# EasyEDA Pro project sensorboardschematic.epro

# Schematic SensorBoardSchematic
Board Name: 3 SensorBoard; Create Date: 2026-05-11; Page Name: P1; Project Name: To The Moon Together - An Amateur Sounding Rocket; Schematic Name: SensorBoardSchematic; Update Date: 2026-05-13; Company: EasyEDA.com; Page Size: A4; Version: V1.0
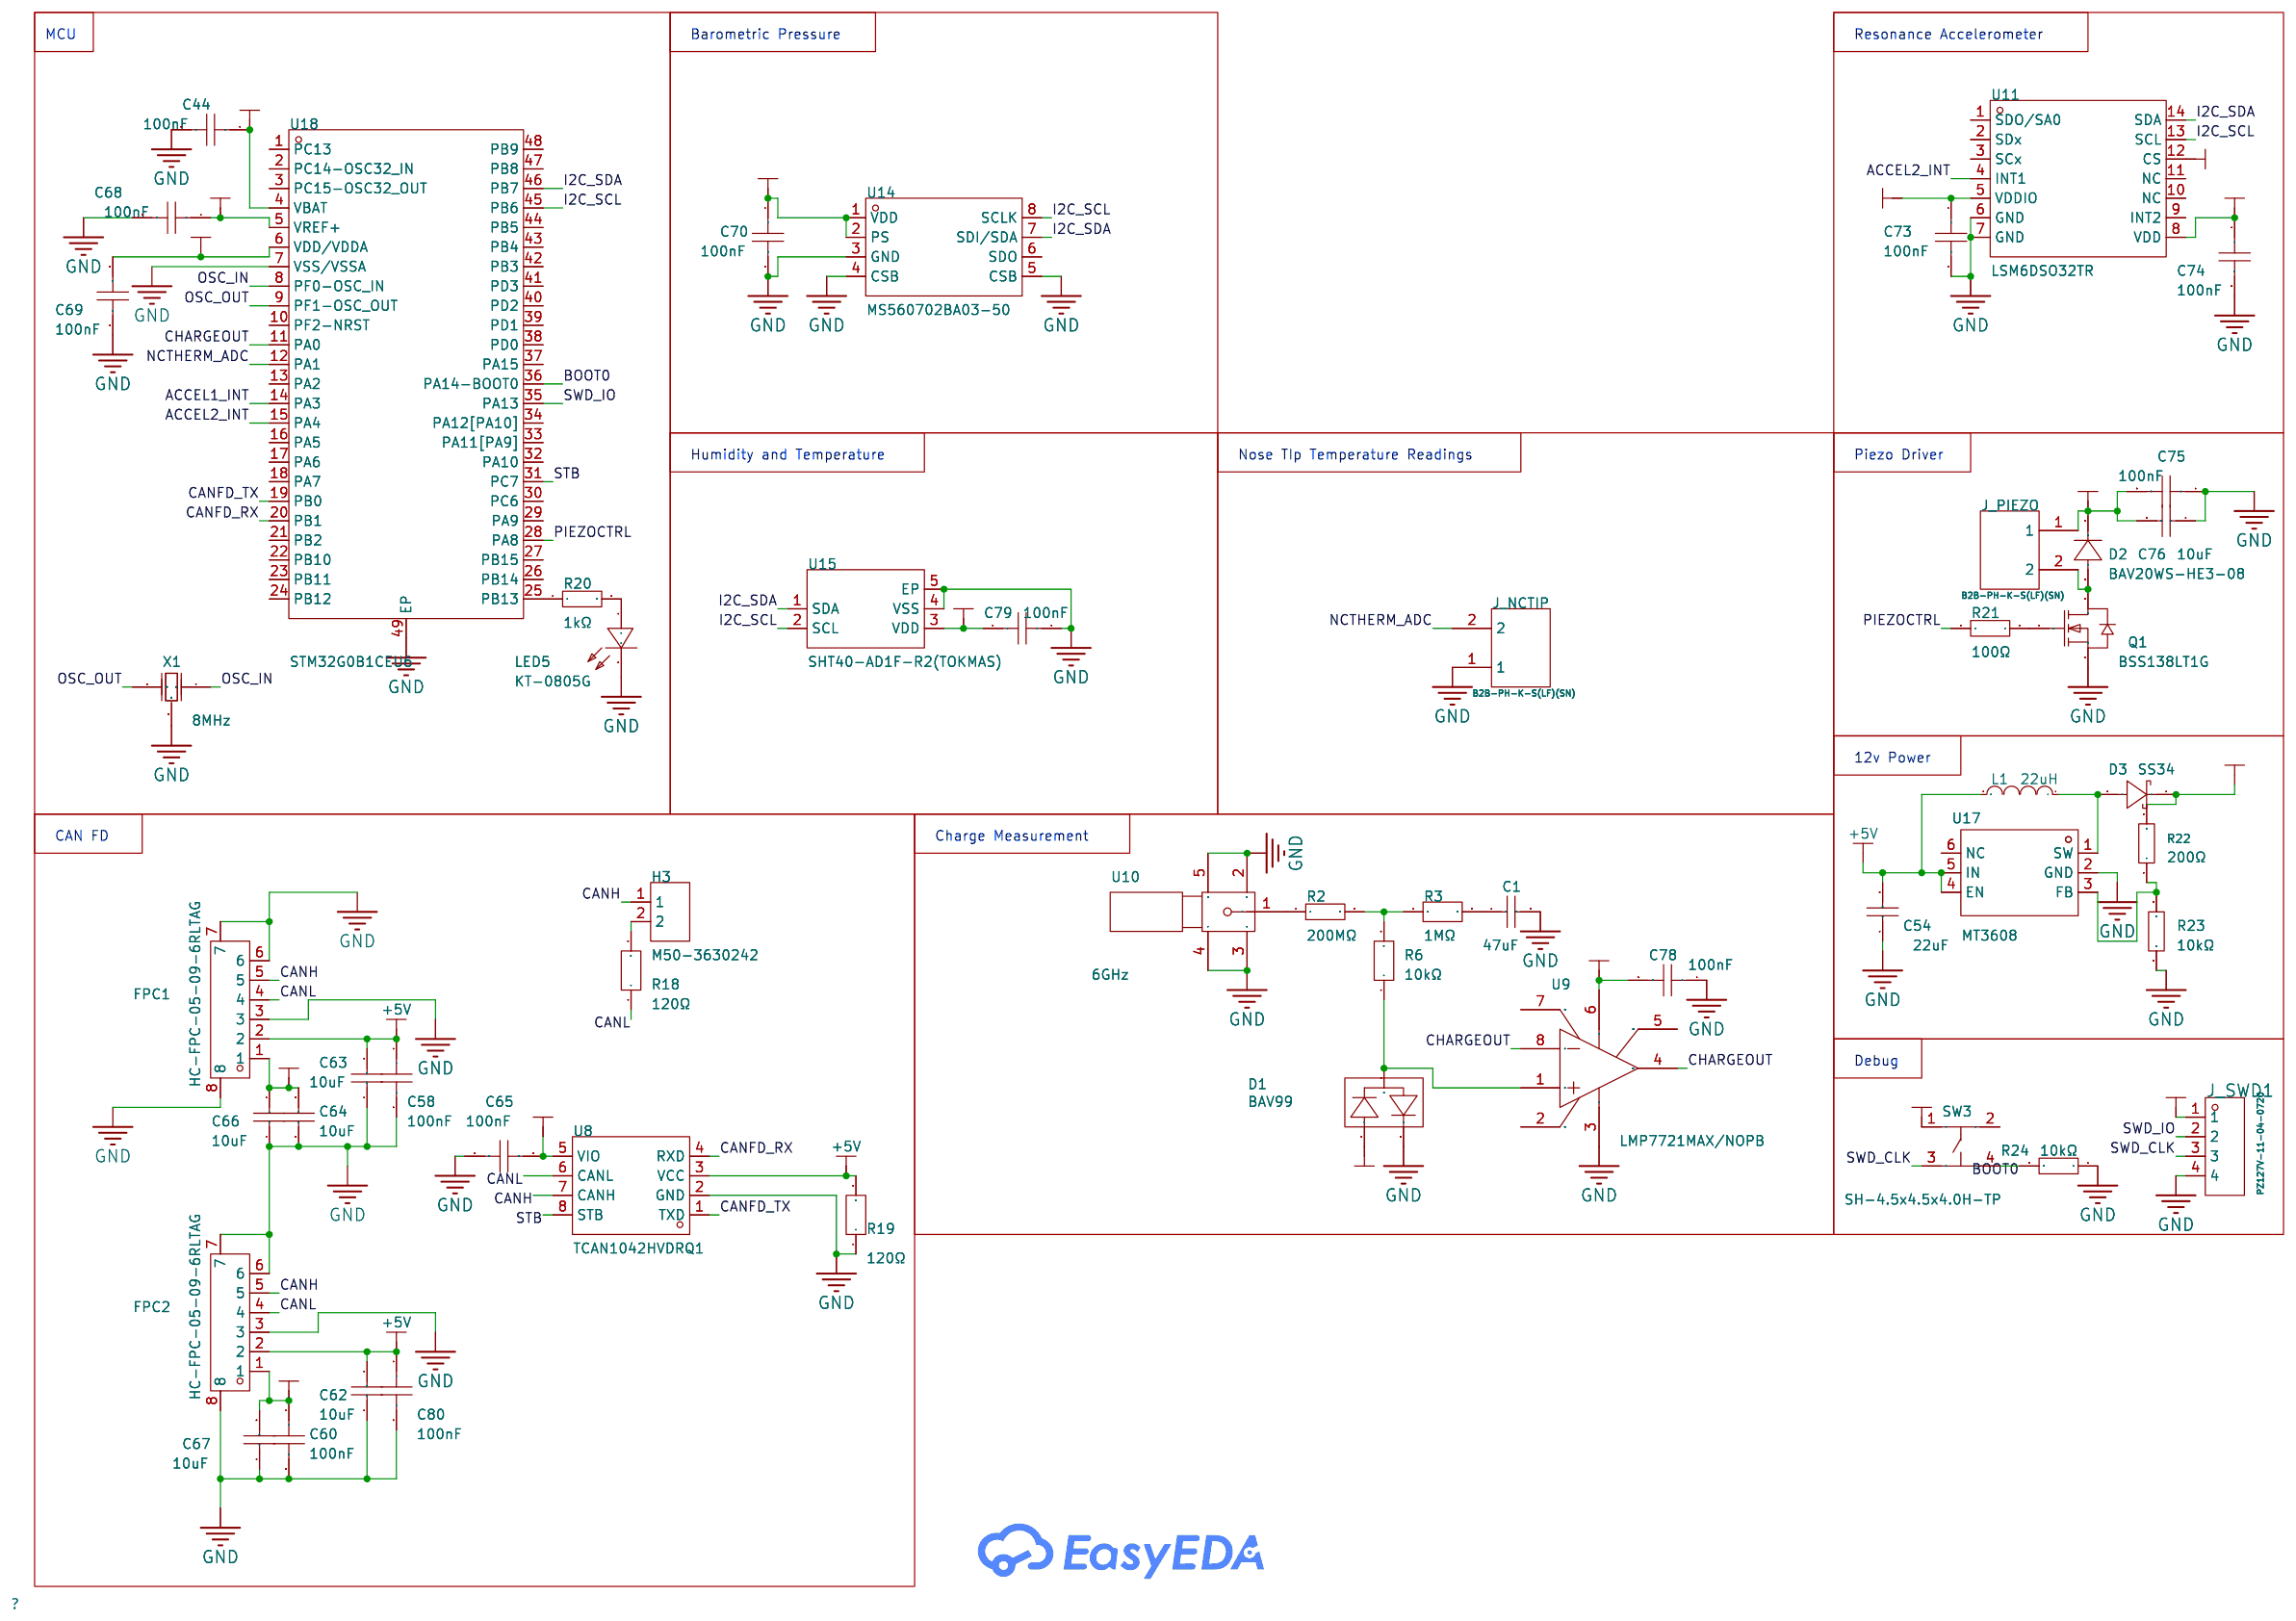
[diagram p0: schematic sheet]

## Parts
C1  47uF  [C0805]
C44  100nF  [C0402]
C54  22uF  [C1206]
C58  100nF  [C0402]
C60  100nF  [C0402]
C62  10uF  [C0402]
C63  10uF  [C0402]
C64  10uF  [C0402]
C65  100nF  [C0402]
C66  10uF  [C0402]
C67  10uF  [C0402]
C68  100nF  [C0402]
C69  100nF  [C0402]
C70  100nF  [C0402]
C73  100nF  [C0402]
C74  100nF  [C0402]
C75  100nF  [C0402]
C76  10uF  [C0402]
C78  100nF  [C0402]
C79  100nF  [C0402]
C80  100nF  [C0402]
D1  BAV99  [SOT-23-3_L2.9-W1.3-P1.90-LS2.4-BR]
D2  BAV20WS-HE3-08  [SOD-323_L1.8-W1.3-LS2.7-RD]
D3  SS34  [SMA_L4.2-W2.7-LS5.0-RD]
FPC1  HC-FPC-05-09-6RLTAG  [FPC-SMD_6P-P0.50_HC-FPC-05-09-6RLTAG]
FPC2  HC-FPC-05-09-6RLTAG  [FPC-SMD_6P-P0.50_HC-FPC-05-09-6RLTAG]
H3  M50-3630242  [HDR-SMD_2P-P1.27_M50-3630242]
J_NCTIP  B2B-PH-K-S(LF)(SN)  [CONN-TH_B2B-PH-K-S]
J_PIEZO  B2B-PH-K-S(LF)(SN)  [CONN-TH_B2B-PH-K-S]
J_SWD1  PZ127V-11-04-0720  [HDR-TH_4P-P1.27-V-M]
L1  22uH  [IND-SMD_L3.2-W2.5]
LED5  KT-0805G  [LED0805-R-RD]
Q1  BSS138LT1G  [SOT-23-3_L2.9-W1.6-P1.90-LS2.8-BR]
R2  200MΩ  [RES-TH_L14.7-W2.54-P10.2-D0.8]
R3  1MΩ  [R0402]
R6  10kΩ  [R0402]
R18  120Ω  [R0402]
R19  120Ω  [R0402]
R20  1kΩ  [R0402]
R21  100Ω  [R0402]
R22  200Ω  [R0603]
R23  10kΩ  [R0402]
R24  10kΩ  [R0402]
SW3  SH-4.5x4.5x4.0H-TP  [SW-SMD_4P-SH-4.5X4.5X4.0H-TP]
U8  TCAN1042HVDRQ1  [SOIC-8_L4.9-W3.9-P1.27-LS6.0-BL]
U9  LMP7721MAX/NOPB  [SOIC-8_L4.9-W3.9-P1.27-LS6.0-BL]
U10  6GHz  [MMCX-TH_DL-MMCX-KWE]
U11  LSM6DSO32TR  [LGA-14_L3.0-W2.5-P0.50-TL]
U14  MS560702BA03-50  [SENSOR-SMD_MS560702BA03-50]
U15  SHT40-AD1F-R2(TOKMAS)  [DFN-4_L1.5-W1.5-P0.80-TL-EP]
U17  MT3608  [SOT-23-6_L2.9-W1.6-P0.95-LS2.8-BL]
U18  STM32G0B1CEU6  [UFQFPN-48_L7.0-W7.0-P0.50-BL-EP]
X1  8MHz  [OSC-SMD_3P-L3.2-W1.3-P1.20-L]

## Library data of the parts
C1 = CL21A476MQYNNNE: Capacitance:47uF Tolerance:±20% Tolerance:±20% Voltage Rating:6.3V Temperature Coefficient:X5R; LCSC Part Name: 47uF ±20% 6.3V; Supplier Part: C16780; Manufacturer: SAMSUNG(三星); Supplier Footprint: 0805; JLCPCB Part Class: Basic Part; Datasheet: https://item.szlcsc.com/datasheet/CL21A476MQYNNNE/17464.html; Supplier: LCSC; Tolerance: ±20%; Voltage Rating: 6.3V; Temperature Coefficient: X5R
C44 C58 C60 C65 C68-C70 C73-C75 C78-C80 = CL05B104KO5NNNC: Capacitance:100nF Tolerance:±10% Tolerance:±10% Voltage Rating:16V Temperature Coefficient:X7R; LCSC Part Name: 100nF ±10% 16V; Supplier Part: C1525; Manufacturer: SAMSUNG(三星); Supplier Footprint: 0402; JLCPCB Part Class: Basic Part; Datasheet: https://item.szlcsc.com/datasheet/CL05B104KO5NNNC/1877.html; Supplier: LCSC; Tolerance: ±10%; Voltage Rating: 16V; Temperature Coefficient: X7R
C54 = CL31A226KAHNNNE: Capacitance:22uF Tolerance:±10% Tolerance:±10% Voltage Rating:25V Temperature Coefficient:X5R; LCSC Part Name: 22uF ±10% 25V; Supplier Part: C12891; Manufacturer: SAMSUNG(三星); Supplier Footprint: 1206; JLCPCB Part Class: Basic Part; Datasheet: https://item.szlcsc.com/datasheet/CL31A226KAHNNNE/13537.html; Supplier: LCSC; Tolerance: ±10%; Voltage Rating: 25V; Temperature Coefficient: X5R
C62-C64 C66 C67 C76 = CL05A106MQ5NUNC: Capacitance:10uF Tolerance:±20% Tolerance:±20% Voltage Rating:6.3V Temperature Coefficient:X5R; LCSC Part Name: 10uF ±20% 6.3V; Supplier Part: C15525; Manufacturer: SAMSUNG(三星); Supplier Footprint: 0402; JLCPCB Part Class: Basic Part; Datasheet: https://item.szlcsc.com/datasheet/CL05A106MQ5NUNC/16204.html; Supplier: LCSC; Tolerance: ±20%; Voltage Rating: 6.3V; Temperature Coefficient: X5R
D1 = BAV99_C916421: Diode Configuration:1 Pair Series Connection Voltage - Forward(Vf@If):1.25V@150mA Voltage - DC Reverse(Vr):75V Current - Rectified:215mA Pd - Power Dissipation:350mW Reverse Leakage Current (Ir):1uA@75V Reverse Recovery Time (trr):4ns Operating Junction T; LCSC Part Name: 75V 215mA; Supplier Part: C916421; Manufacturer: JSMSEMI(杰盛微); Supplier Footprint: SOT-23; JLCPCB Part Class: Extended Part; Datasheet: https://item.szlcsc.com/datasheet/BAV99/990917.html; Supplier: LCSC; Diode Configuration: 1 Pair Series Connection; Voltage - Forward(Vf@If): 1.25V@150mA; Voltage - DC Reverse(Vr): 75V; Current - Rectified: 215mA; Pd - Power Dissipation: 350mW; Reverse Leakage Current (Ir): 1uA@75V; Reverse Recovery Time (trr): 4ns; Operating Junction Temperature Range: -65℃~+150℃; Non-Repetitive Peak Forward Surge Current: 2A
D2 = BAV20WS-HE3-08: Diode Configuration:1 Independent Pd - Power Dissipation:200mW Current - Rectified:250mA Voltage - DC Reverse(Vr):150V Voltage - Forward(Vf@If):1.25V@200mA Non-Repetitive Peak Forward Surge Current:1A Reverse Leakage Current (Ir):100nA@150V Reverse Recove; LCSC Part Name: 150V 250mA; Supplier Part: C3151637; Manufacturer: VISHAY(威世); Supplier Footprint: SOD-323; JLCPCB Part Class: Extended Part; Datasheet: https://item.szlcsc.com/datasheet/BAV20WS-HE3-08/3712173.html; Supplier: LCSC; Diode Configuration: 1 Independent; Pd - Power Dissipation: 200mW; Current - Rectified: 250mA; Voltage - DC Reverse(Vr): 150V; Voltage - Forward(Vf@If): 1.25V@200mA; Non-Repetitive Peak Forward Surge Current: 1A; Reverse Leakage Current (Ir): 100nA@150V; Reverse Recovery Time (trr): 50ns; Operating Junction Temperature Range: -55℃~+150℃
D3 = SS34_C2837271: Diode Configuration:- Voltage - Forward(Vf@If):550mV@3A Voltage - DC Reverse(Vr):40V Current - Rectified:3A Reverse Leakage Current (Ir):-; LCSC Part Name: 电压:40V 电流:3A; Supplier Part: C2837271; Manufacturer: JSMSEMI(杰盛微); Supplier Footprint: SMA(DO-214AC); JLCPCB Part Class: Extended Part; Datasheet: https://item.szlcsc.com/datasheet/SS34/3007843.html; Supplier: LCSC; Voltage - Forward(Vf@If): 550mV@3A; Voltage - DC Reverse(Vr): 40V; Current - Rectified: 3A
FPC1 FPC2 = HC-FPC-05-09-6RLTAG: Locking Feature:Hinged Lid Contact Type:Double-Sided Contacts, Top and Bottom Entry Number of Contacts:6P Pitch:0.5mm Mounting Type:Surface Mount, Right Angle FFC, FCB Thickness:0.3mm FFC, FCB Thickness:0.3mm Height Above Board:1mm Contact Material:Copper; LCSC Part Name: 翻盖式 双侧触点/上下接 P数:6P 间距:0.5mm; Supplier Part: C5213748; Manufacturer: HCTL(华灿天禄); Supplier Footprint: SMD,P=0.5mm,卧贴; JLCPCB Part Class: Extended Part; Datasheet: https://item.szlcsc.com/datasheet/HC-FPC-05-09-6RLTAG/5909040.html; Supplier: LCSC; Locking Feature: Hinged Lid; Contact Type: Double-Sided Contacts, Top and Bottom Entry; Number of Contacts: 6P; Pitch: 0.5mm; Mounting Type: Surface Mount, Right Angle; FFC, FCB Thickness: 0.3mm; Height Above Board: 1mm; Contact Material: Copper Alloy; Operating Temperature: -55℃~+85℃
H3 = M50-3630242: Pitch:1.27mm Row Spacing:- Circluar Pins/Square Pins:Pin Header Mounting Type:Surface Mount,Vertical Number of Rows:1 Number of Pins:2P Current Rating:1A Length of Mating Pin:3mm Insulation Height:1mm Length of End Connection Pin:- Contact Material:Brass; LCSC Part Name: 间距:1.27mm 方针 立贴; Supplier Part: C7297891; Manufacturer: Harwin; Supplier Footprint: SMD,P=1.27mm; JLCPCB Part Class: Extended Part; Datasheet: https://item.szlcsc.com/datasheet/M50-3630242/8267898.html; Supplier: LCSC; Pitch: 1.27mm; Circluar Pins/Square Pins: Pin Header; Mounting Type: Surface Mount,Vertical; Number of Rows: 1; Number of Pins: 2P; Current Rating: 1A; Length of Mating Pin: 3mm; Insulation Height: 1mm; Contact Material: Brass; Contact Plating: Tin; Operating Temperature: -40℃~+105℃; Color: Black
J_NCTIP J_PIEZO = B2B-PH-K-S(LF)(SN): Pins Structure:1x2P Pitch:2mm Mounting Type:Through Hole Reference Series:PH Number of Pins:2P Number of Rows:1 Number of PINs Per Row:2 Row Spacing:- Current Rating:2A Contact Material:Brass Contact Plating:Tin Operating Temperature:-25℃~+85℃ Operating T; LCSC Part Name: 1x2P 间距:2mm 直插 系列:PH; Supplier Part: C131337; Manufacturer: JST; Supplier Footprint: 插件,P=2mm; JLCPCB Part Class: Extended Part; Datasheet: https://item.szlcsc.com/datasheet/B2B-PH-K-S(LF)(SN)/142630.html; Supplier: LCSC; Pins Structure: 1x2P; Pitch: 2mm; Mounting Type: Through Hole; Reference Series: PH; Number of Pins: 2P; Number of Rows: 1; Number of PINs Per Row: 2; Current Rating: 2A; Contact Material: Brass; Contact Plating: Tin; Operating Temperature: -25℃~+85℃; Voltage Rating: 100V; Plastic Material: PA66; Flame Retardant Rating: UL94V-0; Supplementary Features: K Pin; Color: White; Z-Height of the Board: 6mm; X-Length of Bottom Edge on Board (Spacing Line): 5.9mm; Y-Width of Bottom Edge on Board: 4.5mm
J_SWD1 = PZ127V-11-04-0720: Pin Structure:1x4P Pitch:1.27mm Row Spacing:- Circluar Pins/Square Pins:Pin Header Mounting Type:Through Hole Number of Rows:1 Number of Pins:4P Current Rating:1A Voltage Rating (Max):- Length of Mating Pin:3.9mm Insulation Height:1mm Length of End Connec; LCSC Part Name: 1x4P 间距:1.27mm 方针 直插; Supplier Part: C541879; Manufacturer: XFCN(兴飞); Supplier Footprint: 插件,P=1.27mm; JLCPCB Part Class: Extended Part; Datasheet: https://item.szlcsc.com/datasheet/PZ127V-11-04-0720/562500.html; Supplier: LCSC; Pin Structure: 1x4P; Pitch: 1.27mm; Circluar Pins/Square Pins: Pin Header; Mounting Type: Through Hole; Number of Rows: 1; Number of Pins: 4P; Current Rating: 1A; Length of Mating Pin: 3.9mm; Insulation Height: 1mm; Length of End Connection Pin: 2.3mm; Contact Material: Brass; Operating Temperature: -40℃~+105℃; Color: Black
L1 = NLV32T-220J-EF: Inductance: Tolerance:±5% Tolerance:±5% Rated Current: Saturation Current (Isat):- DC Resistance (DCR): Ratings:-; LCSC Part Name: 22uH ±5%; Supplier Part: C295143; Manufacturer: TDK; Supplier Footprint: 1210; JLCPCB Part Class: Extended Part; Datasheet: https://atta.szlcsc.com/upload/public/pdf/source/20190114/C295361_7F4084769062E2B02C18E7F2085EC2BC.pdf; Supplier: LCSC; Tolerance: ±5%
LED5 = KT-0805G: Lamp Holder Type:- Illumination Color:Emerald Green Voltage - Forward(Vf):2.6V~3.1V Voltage - Forward(Vf):2.6V~3.1V Power(Watts):100mW Forward Current:5mA Wavelength - Dominant:513nm~528nm Wavelength - Dominant:513nm~528nm Peak Wavelength:525nm Diode Conf; LCSC Part Name: 0805 翠绿 高亮; Supplier Part: C2297; Manufacturer: KENTO; Supplier Footprint: 0805; JLCPCB Part Class: Basic Part; Datasheet: https://item.szlcsc.com/datasheet/KT-0805G/2670.html; Supplier: LCSC; Illumination Color: Emerald Green; Voltage - Forward(Vf): 2.6V~3.1V; Power(Watts): 100mW; Forward Current: 5mA; Wavelength - Dominant: 513nm~528nm; Peak Wavelength: 525nm; Diode Configuration: Discrete Diode; Lens Color: Water Clear; Luminous Intensity: 430mcd; Viewing Angle: 120°; Operating Temperature: -40℃~+85℃
Q1 = BSS138LT1G: Number:1 N-Channel Drain to Source Voltage:50V Current - Continuous Drain(Id):200mA RDS(on):5.6Ω@2.75V Pd - Power Dissipation:225mW Gate Threshold Voltage (Vgs(th)):500mV Input Capacitance(Ciss):50pF@25V Reverse Transfer Capacitance (Crss@Vds):5pF@25V Ope; LCSC Part Name: 1个N沟道 耐压:50V 电流:200mA; Supplier Part: C82045; Manufacturer: onsemi(安森美); Supplier Footprint: SOT-23; JLCPCB Part Class: Extended Part; Datasheet: https://item.szlcsc.com/datasheet/BSS138LT1G/83200.html; Supplier: LCSC; Number: 1 N-Channel; Drain to Source Voltage: 50V; Current - Continuous Drain(Id): 200mA; RDS(on): 5.6Ω@2.75V; Pd - Power Dissipation: 225mW; Gate Threshold Voltage (Vgs(th)): 500mV; Input Capacitance(Ciss): 50pF@25V; Reverse Transfer Capacitance (Crss@Vds): 5pF@25V; Operating Temperature: -55℃~+150℃
R2 = SM102032006FE: Type:Thick Film Resistor Resistance: Tolerance:±1% Tolerance:±1% Power(Watts):1W Temperature Coefficient:±50ppm/℃ Temperature Coefficient:±50ppm/℃ Operating Temperature:-55℃~+110℃ Operating Temperature:-55℃~+110℃; LCSC Part Name: 厚膜电阻 200MΩ ±1% 1W; Supplier Part: C2641611; Manufacturer: Ohmite; Supplier Footprint: 插件; JLCPCB Part Class: Extended Part; Datasheet: https://item.szlcsc.com/datasheet/SM102032006FE/2733517.html; Supplier: LCSC; Type: Thick Film Resistor; Tolerance: ±1%; Power(Watts): 1W; Temperature Coefficient: ±50ppm/℃; Operating Temperature: -55℃~+110℃
R3 = FRC0402F1004TS: Type:Thick Film Resistor Resistance:1MΩ Tolerance:±1% Tolerance:±1% Power(Watts):62.5mW Voltage-Supply(Max):50V Temperature Coefficient:±100ppm/℃ Temperature Coefficient:±100ppm/℃ Operating Temperature:-55℃~+155℃ Operating Temperature:-55℃~+155℃; LCSC Part Name: 1MΩ ±1% 62.5mW 厚膜电阻; Supplier Part: C2909328; Manufacturer: FOJAN(富捷); Supplier Footprint: 0402; JLCPCB Part Class: Extended Part; Supplier: LCSC; Type: Thick Film Resistor; Tolerance: ±1%; Power(Watts): 62.5mW; Voltage-Supply(Max): 50V; Temperature Coefficient: ±100ppm/℃; Operating Temperature: -55℃~+155℃
R6 = FRC0402F1002TS: Type:Thick Film Resistor Resistance:10kΩ Tolerance:±1% Tolerance:±1% Power(Watts):62.5mW Voltage-Supply(Max):50V Temperature Coefficient:±100ppm/℃ Temperature Coefficient:±100ppm/℃ Operating Temperature:-55℃~+155℃ Operating Temperature:-55℃~+155℃; LCSC Part Name: 10kΩ ±1% 62.5mW 厚膜电阻; Supplier Part: C2906861; Manufacturer: FOJAN(富捷); Supplier Footprint: 0402; JLCPCB Part Class: Extended Part; Supplier: LCSC; Type: Thick Film Resistor; Tolerance: ±1%; Power(Watts): 62.5mW; Voltage-Supply(Max): 50V; Temperature Coefficient: ±100ppm/℃; Operating Temperature: -55℃~+155℃
R18 R19 = FRC0402F1200TS: Type:Thick Film Resistor Resistance:120Ω Tolerance:±1% Tolerance:±1% Power(Watts):62.5mW Voltage-Supply(Max):50V Temperature Coefficient:±100ppm/℃ Temperature Coefficient:±100ppm/℃ Operating Temperature:-55℃~+155℃ Operating Temperature:-55℃~+155℃; LCSC Part Name: 120Ω ±1% 62.5mW 厚膜电阻; Supplier Part: C2909315; Manufacturer: FOJAN(富捷); Supplier Footprint: 0402; JLCPCB Part Class: Extended Part; Datasheet: https://item.szlcsc.com/datasheet/FRC0402F1200TS/3186250.html; Supplier: LCSC; Type: Thick Film Resistor; Tolerance: ±1%; Power(Watts): 62.5mW; Voltage-Supply(Max): 50V; Temperature Coefficient: ±100ppm/℃; Operating Temperature: -55℃~+155℃
R20 = 0402WGF1001TCE: Type:Thick Film Resistor Resistance:1kΩ Tolerance:±1% Tolerance:±1% Power(Watts):62.5mW Voltage-Supply(Max):50V Temperature Coefficient:±100ppm/℃ Temperature Coefficient:±100ppm/℃ Operating Temperature:-55℃~+155℃ Operating Temperature:-55℃~+155℃; LCSC Part Name: 1kΩ ±1% 62.5mW 厚膜电阻; Supplier Part: C11702; Manufacturer: UNI-ROYAL(厚声); Supplier Footprint: 0402; JLCPCB Part Class: Basic Part; Datasheet: https://item.szlcsc.com/datasheet/0402WGF1001TCE/12256.html; Supplier: LCSC; Type: Thick Film Resistor; Tolerance: ±1%; Power(Watts): 62.5mW; Voltage-Supply(Max): 50V; Temperature Coefficient: ±100ppm/℃; Operating Temperature: -55℃~+155℃
R21 = 0402WGF1000TCE: Type:Thick Film Resistors Resistance: Tolerance:±1% Tolerance:±1% Power(Watts): Overload Voltage (Max): Temperature Coefficient:±200ppm/℃ Temperature Coefficient:±200ppm/℃ Operating Temperature Range:-55℃~+155℃ Operating Temperature Range:-55℃~+155℃; LCSC Part Name: 100Ω ±1% 62.5mW 厚膜电阻; Supplier Part: C25076; Manufacturer: UNI-ROYAL(厚声); Supplier Footprint: 0402; JLCPCB Part Class: Basic Part; Datasheet: https://atta.szlcsc.com/upload/public/pdf/source/20200306/C422600_1E6D84923E4A46A82E41ADD87F860B5C.pdf; Supplier: LCSC; Type: Thick Film Resistors; Tolerance: ±1%; Temperature Coefficient: ±200ppm/℃; Operating Temperature Range: -55℃~+155℃
R22 = 0603WAF2000T5E: Type:Thick Film Resistor Resistance:200Ω Tolerance:±1% Tolerance:±1% Power(Watts):100mW Voltage-Supply(Max):75V Temperature Coefficient:±100ppm/℃ Temperature Coefficient:±100ppm/℃ Operating Temperature:-55℃~+155℃ Operating Temperature:-55℃~+155℃; LCSC Part Name: 200Ω ±1% 100mW 厚膜电阻; Supplier Part: C8218; Manufacturer: UNI-ROYAL(厚声); Supplier Footprint: 0603; JLCPCB Part Class: Basic Part; Datasheet: https://item.szlcsc.com/datasheet/0603WAF2000T5E/8708.html; Supplier: LCSC; Type: Thick Film Resistor; Tolerance: ±1%; Power(Watts): 100mW; Voltage-Supply(Max): 75V; Temperature Coefficient: ±100ppm/℃; Operating Temperature: -55℃~+155℃
R23 R24 = 0402WGF1002TCE: Type:Thick Film Resistor Resistance:10kΩ Tolerance:±1% Tolerance:±1% Power(Watts):62.5mW Voltage-Supply(Max):50V Temperature Coefficient:±100ppm/℃ Temperature Coefficient:±100ppm/℃ Operating Temperature:-55℃~+155℃ Operating Temperature:-55℃~+155℃; LCSC Part Name: 10kΩ ±1% 62.5mW 厚膜电阻; Supplier Part: C25744; Manufacturer: UNI-ROYAL(厚声); Supplier Footprint: 0402; JLCPCB Part Class: Basic Part; Datasheet: https://item.szlcsc.com/datasheet/0402WGF1002TCE/26487.html; Supplier: LCSC; Type: Thick Film Resistor; Tolerance: ±1%; Power(Watts): 62.5mW; Voltage-Supply(Max): 50V; Temperature Coefficient: ±100ppm/℃; Operating Temperature: -55℃~+155℃
SW3 = SH-4.5x4.5x4.0H-TP: LCSC Part Name: TS4540TP 250gf编带; Supplier Part: C52092029; Manufacturer: SHOU HAN(首韩); Supplier Footprint: SMD; JLCPCB Part Class: Extended Part; Datasheet: https://item.szlcsc.com/datasheet/SH-4.5x4.5x4.0H-TP/54864053.html; Supplier: LCSC
U8 = TCAN1042HVDRQ1: Type:CAN FD Transceiver Data Rate:2Mbps Voltage - Supply:4.5V~5.5V Voltage - Supply:4.5V~5.5V Current - Supply:80mA Operating Temperature:-55℃~+125℃ Operating Temperature:-55℃~+125℃ Number of Channels:- Quiescent Supply Current:22uA; LCSC Part Name: TCAN1042-Q1 汽车故障保护 CAN 收发器，带 CAN FD; Supplier Part: C485807; Manufacturer: TI(德州仪器); Supplier Footprint: SOIC-8; JLCPCB Part Class: Extended Part; Datasheet: https://www.ti.com/cn/lit/gpn/tcan1042hv-q1; Supplier: LCSC; Type: CAN FD Transceiver; Data Rate: 2Mbps; Voltage - Supply: 4.5V~5.5V; Current - Supply: 80mA; Operating Temperature: -55℃~+125℃; Quiescent Supply Current: 22uA
U9 = LMP7721MAX/NOPB: Number of Channels:1 Maximum Power Supply Range (Vdd-Vss):5.5V Rail to Rail:Rail-to-Rail Output Gain Bandwidth Product:17MHz Vos - Input Offset Voltage:26uV Input Offset Voltage Drift(Vos TC):1.5uV/℃ Slew Rate:12.76V/us Ib - Input Bias Current:0.003pA Inp; LCSC Part Name: 超低输入偏置电流精密放大器; Supplier Part: C2864387; Manufacturer: TI(德州仪器); Supplier Footprint: SOIC-8; JLCPCB Part Class: Extended Part; Datasheet: https://www.ti.com/cn/lit/gpn/lmp7721; Supplier: LCSC; Number of Channels: 1; Maximum Power Supply Range (Vdd-Vss): 5.5V; Rail to Rail: Rail-to-Rail Output; Gain Bandwidth Product: 17MHz; Vos - Input Offset Voltage: 26uV; Input Offset Voltage Drift(Vos TC): 1.5uV/℃; Slew Rate: 12.76V/us; Ib - Input Bias Current: 0.003pA; Input Offset Current(Ios): 0.006pA; Input Voltage Noise Density: 6.5nV/√Hz@1kHz; Common Mode Rejection Ratio(CMRR): 100dB; Quiescent Current: 1.3mA; Output Current: 46mA; Operating Temperature: -40℃~+125℃; Single supply: 1.8V~5.5V
U10 = BWMMCX-KWE: Connector Type:Board Side Interface:Inner Bore Number of Ports:1 Interface Diameter:3.45mm Interface Length/Height:6.8mm Frequency:6GHz RF Series:- Impedance:50Ω Style:Elbow Operating Temperature Range:- Operating Temperature Range:-; LCSC Part Name: 内孔 弯头; Supplier Part: C5137199; Manufacturer: BAT WIRELESS(蝙蝠无线); Supplier Footprint: 插件; JLCPCB Part Class: Extended Part; Datasheet: https://item.szlcsc.com/datasheet/BWMMCX-KWE/5745896.html; Supplier: LCSC; Connector Type: Board Side; Interface: Inner Bore; Number of Ports: 1; Interface Diameter: 3.45mm; Interface Length/Height: 6.8mm; Impedance: 50Ω; Style: Elbow
U11 = LSM6DSO32TR: Sensor Type:加速度计陀螺仪 Operating Temperature:-40℃~+85℃ Operating Temperature:-40℃~+85℃; Supplier Part: C1864162; Manufacturer: ST(意法半导体); Supplier Footprint: LGA-14(2.5x3); JLCPCB Part Class: Extended Part; Datasheet: https://atta.szlcsc.com/upload/public/pdf/source/20210701/34CD2F0BBC0E28C2A99EB6D9CC8DCB24.pdf; Supplier: LCSC; Sensor Type: 加速度计陀螺仪; Operating Temperature: -40℃~+85℃
U14 = MS560702BA03-50: Pressure range:1Kpa~1.2bar Pressure range:1Kpa~1.2bar Voltage - Supply:1.8V~3.6V Voltage - Supply:1.8V~3.6V Standby Current:140nA Interface:SPI；I2C Module:Yes Absolute Accuracy:1.5mbar Relative Accuracy:- Features:片内温度输出；集成ADC与数字接口；片内校准与非易失存储 Temperature; LCSC Part Name: MS5607-02BA03; Supplier Part: C97627; Manufacturer: TE Connectivity(泰科电子); Supplier Footprint: SMD-8P; JLCPCB Part Class: Extended Part; Datasheet: https://item.szlcsc.com/datasheet/MS560702BA03-50/98835.html; Supplier: LCSC; Pressure range: 1Kpa~1.2bar; Voltage - Supply: 1.8V~3.6V; Standby Current: 140nA; Interface: SPI；I2C; Module: Yes; Absolute Accuracy: 1.5mbar; Features: 片内温度输出；集成ADC与数字接口；片内校准与非易失存储; Operating Temperature: -40℃~+85℃
U15 = SHT40-AD1F-R2(TOKMAS): Supplier Part: C54823945; Manufacturer: Tokmas(托克马斯); Supplier Footprint: DFN-4(1.5x1.5); JLCPCB Part Class: Extended Part; Datasheet: https://item.szlcsc.com/datasheet/SHT40-AD1F-R2(TOKMAS)/58293138.html; Supplier: LCSC
U17 = MT3608: Function:Boost Output Type:Adjustable Voltage - Supply:2V~24V Voltage - Supply:2V~24V Output Voltage:- Output Voltage:- Output Current:2A Frequency - Switching:1.2MHz Frequency - Switching:1.2MHz Operating Temperature:-40℃~+85℃ Operating Temperature:-40℃~; LCSC Part Name: 老版本 高效1.2MHz 2A升压转换器; Supplier Part: C84817; Manufacturer: 西安航天民芯; Supplier Footprint: SOT-23-6; JLCPCB Part Class: Extended Part; Datasheet: https://item.szlcsc.com/datasheet/MT3608/85988.html; Supplier: LCSC; Function: Boost; Output Type: Adjustable; Voltage - Supply: 2V~24V; Output Current: 2A; Frequency - Switching: 1.2MHz; Operating Temperature: -40℃~+85℃; Synchronous Rectifier: No; Number of Outputs: 1; Topology: Boost; Quiescent Current: 100uA；1.6mA; Switch tube (built-in/external): Built-in
U18 = STM32G0B1CEU6: LCSC Part Name: 主流Arm Cortex-M0+ 32位MCU，最高512KB闪存，144KB内存，6个USART，定时器，ADC，DAC，通信接口，1.7-3.6V; Supplier Part: C2829190; Manufacturer: ST(意法半导体); Supplier Footprint: UFQFPN-48(7x7); JLCPCB Part Class: Extended Part; Datasheet: https://item.szlcsc.com/datasheet/STM32G0B1CEU6/2979251.html; Supplier: LCSC
X1 = CSTNE8M00GH5C000R0: Frequency:8MHz Built - in Load Capacitance:33pF Resonant Impedance:40Ω Operating Temperature:-40℃~+125℃ Operating Temperature:-40℃~+125℃; LCSC Part Name: 8MHz ±0.07% 内置负载电容:33pF; Supplier Part: C341525; Manufacturer: muRata(村田); Supplier Footprint: SMD3213-3P; JLCPCB Part Class: Extended Part; Datasheet: https://item.szlcsc.com/datasheet/CSTNE8M00GH5C000R0/318917.html; Supplier: LCSC; Built - in Load Capacitance: 33pF; Resonant Impedance: 40Ω; Operating Temperature: -40℃~+125℃

## Nets
3V3: C44.1 C60.1 C64.2 C65.2 C66.2 C67.2 C68.1 C69.2 C70.1 C73.1 C74.1 C78.2 C79.2 D1.1 FPC1.1 FPC2.1 J_SWD1.1 SW3.1 U8.5(VIO) U9.6(V+) U11.5(VDDIO) U11.8(VDD) U11.12(CS) U14.1(VDD) U14.2(PS) U15.3(VDD) U18.4(VBAT) U18.5(VREF+) U18.6(VDD/VDDA)
+5V: C54.2 C58.1 C62.2 C63.2 C80.1 FPC1.2 FPC2.2 L1.2 R19.2 U8.3(VCC) U17.4(EN) U17.5(IN)
+12V: C75.2 C76.2 D2.1(C) D3.1(K) J_PIEZO.1 R22.2
GND: C1.2 C44.2 C54.1 C58.2 C60.2 C62.1 C63.1 C64.1 C65.1 C66.1 C67.1 C68.2 C69.1 C70.2 C73.2 C74.2 C75.1 C76.1 C78.1 C79.1 C80.2 D1.2 FPC1.3 FPC1.6 FPC1.7 FPC1.8 FPC2.3 FPC2.6 FPC2.7 FPC2.8 J_NCTIP.1 J_SWD1.4 LED5.2(K) Q1.2(S) R19.1 R23.1 R24.1 U8.2(GND) U9.3(V-) U10.2 U10.3 U10.4 U10.5 U11.6(GND) U11.7(GND) U14.3(GND) U14.4(CSB) U14.5(CSB) U15.4(VSS) U15.5(EP) U17.2(GND) U18.7(VSS/VSSA) U18.49(EP) X1.2(GND)
ACCEL1_INT: U18.14(PA3)
ACCEL2_INT: U11.4(INT1) U18.15(PA4)
BOOT0: R24.2 SW3.4 U18.36(PA14-BOOT0)
CANFD_RX: U8.4(RXD) U18.20(PB1)
CANFD_TX: U8.1(TXD) U18.19(PB0)
CANH: FPC1.5 FPC2.5 H3.1 U8.7(CANH)
CANL: FPC1.4 FPC2.4 R18.1 U8.6(CANL)
CHARGEOUT: U9.4(VOUT) U9.8(-IN) U18.11(PA0)
I2C_SCL: U11.13(SCL) U14.8(SCLK) U15.2(SCL) U18.45(PB6)
I2C_SDA: U11.14(SDA) U14.7(SDI/SDA) U15.1(SDA) U18.46(PB7)
NCTHERM_ADC: J_NCTIP.2 U18.12(PA1)
OSC_IN: U18.8(PF0-OSC_IN) X1.1(OSC1)
OSC_OUT: U18.9(PF1-OSC_OUT) X1.3(OSC2)
PIEZOCTRL: R21.1 U18.28(PA8)
STB: U8.8(STB) U18.31(PC7)
SWD_CLK: J_SWD1.3 SW3.3
SWD_IO: J_SWD1.2 U18.35(PA13)
Net-(C1-1): C1.1 R3.2
Net-(D1-3): D1.3 R6.1 U9.1(+IN)
Net-(D2-2): D2.2(A) J_PIEZO.2 Q1.3(D)
Net-(D3-2): D3.2(A) L1.1 U17.1(SW)
Net-(H3-2): H3.2 R18.2
Net-(LED5-1): LED5.1(A) R20.2
Net-(Q1-1): Q1.1(G) R21.2
Net-(R2-1): R2.1 U10.1
Net-(R2-2): R2.2 R3.1 R6.2
Net-(R20-1): R20.1 U18.25(PB13)
Net-(R22-1): R22.1 R23.2 U17.3(FB)

Not connected (* = marked no-connect by the designer): SW3 2; U9 2(N/C) 5(N/C) 7(N/C); U11 1(SDO/SA0) 2(SDx) 3(SCx) 9(INT2) 10(NC) 11(NC); U14 6(SDO); U17 6(NC); U18 1(PC13) 2(PC14-OSC32_IN) 3(PC15-OSC32_OUT) 10(PF2-NRST) 13(PA2) 16(PA5) 17(PA6) 18(PA7) 21(PB2) 22(PB10) 23(PB11) 24(PB12) 26(PB14) 27(PB15) 29(PA9) 30(PC6) 32(PA10) 33(PA11[PA9]) 34(PA12[PA10]) 37(PA15) 38(PD0) 39(PD1) 40(PD2) 41(PD3) 42(PB3) 43(PB4) 44(PB5) 47(PB8) 48(PB9)

## Notes on the sheet
- MCU
- Barometric Pressure
- Resonance Accelerometer
- Humidity and Temperature
- Nose TIp Temperature Readings
- Piezo Driver
- 12v Power
- CAN FD
- Charge Measurement
- Debug
